# Altium project Soil_moisture.PrjPcb
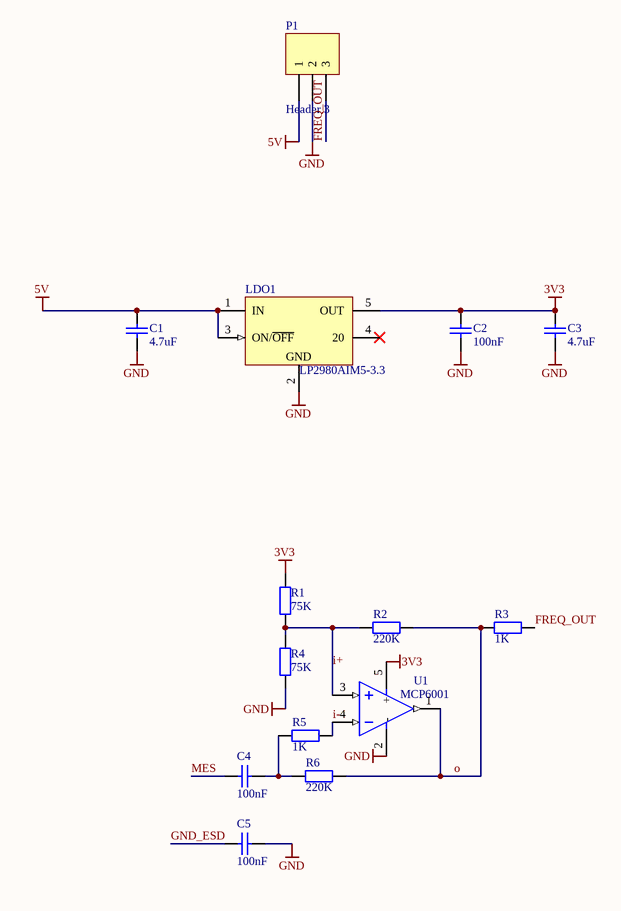
[diagram p0: Soil_moisture.SchDoc]
1 sheet, 14 parts. Net scope: global (net labels, ports and power ports of the same name join across sheets).
Board file: Soil_moisture.PcbDoc

## Sheet Soil_moisture.SchDoc
size A4

### Parts
C1  4.7uF  [FP_0603_CAP_080]
C2  100nF  [FP_0603_CAP_080]
C3  4.7uF  [FP_0603_CAP_080]
C4  100nF  [FP_0603_CAP_080]
C5  100nF  [FP_0603_CAP_080]
LDO1  LP2980AIM5-3.3  [SUPPLY_SOT23-5]
P1  Header 3  [HDR1X3]
R1  75K  [FP_0603_RES]
R2  220K  [FP_0603_RES]
R3  1K  [FP_0603_RES]
R4  75K  [FP_0603_RES]
R5  1K  [FP_0603_RES]
R6  220K  [FP_0603_RES]
U1  MCP6001  [ANALOG_SOT23-5]

### Nets
3V3: C2.2 C3.2 LDO1.5(OUT) R1.1 U1.5(+)
5V: C1.2 LDO1.1(IN) LDO1.3(ON/~{OFF}) P1.1
GND: C1.1 C2.1 C3.1 C5.2 LDO1.2(GND) P1.2 R4.2 U1.2(-)
FREQ_OUT: P1.3 R3.2
GND_ESD: C5.1
i+: R1.2 R2.1 R4.1 U1.3(IN1+)
i-: R5.2 U1.4(IN1-)
MES: C4.1
o: R2.2 R3.1 R6.2 U1.1(OUT1)
NetC4_2: C4.2 R5.1 R6.1

Not connected (* = marked no-connect by the designer): LDO1 4(20)*

### Library data of the parts
C1-C5 = Cap: Capacitor; Order info: TODO; Tûrés: 10%
  C1 C3: Value: 4.7uF
  C2 C4 C5: Value: 100nF
LDO1 = LP2980IM5-3.8: Micropower 50 mA Ultra Low-Dropout Regulator In SOT-23 and micro SMD Packages
P1 = Header 3: Header, 3-Pin; LatestRevisionDate: 17-Jul-2002; LatestRevisionNote: Re-released for DXP Platform.; Publisher: Altium Limited
R1-R6 = Res3: Resistor; Order info: TODO; Tûrés: 5%
  R1 R4: Value: 75K
  R2 R6: Value: 220K
  R3 R5: Value: 1K
U1 = MCP6001: Order info: http://hu.farnell.com/microchip/mcp6001t-i-ot/op-amp-cmos-1mhz-1-8v-smd-6001/dp/4974992